# Altium schematic sheet LED controller - v1.0.SchDoc
size A4
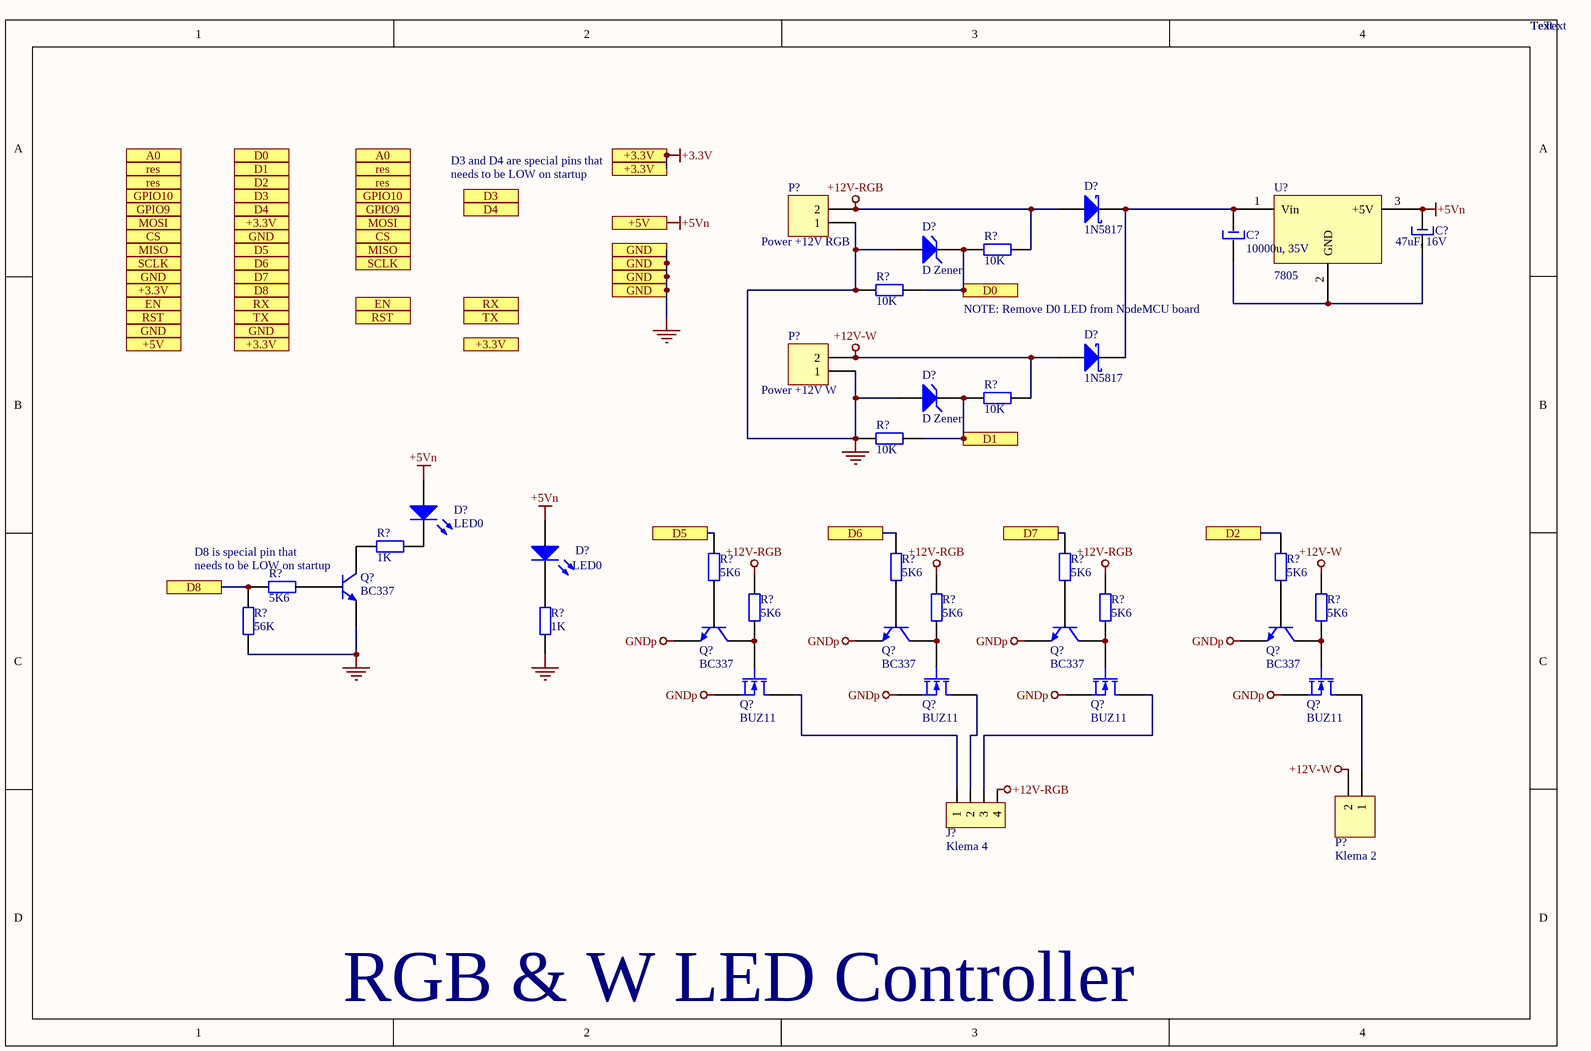
[diagram p0: LED controller - v1.0.SchDoc]

## Parts
(Parts that share a designator on the sheet are numbered #1, #2 ... from top to bottom, then left to right.)
C?#1  47uF, 16V  [Capacitor 10mikro]
C?#2  10000u, 35V  [Capacitor 10000u]
D?#1  1N5817  [Diode Schottky]
D?#2  D Zener  [DIODE-0.7]
D?#3  1N5817  [Diode Schottky]
D?#4  D Zener  [DIODE-0.7]
D?#5  LED0  [LED-0]
D?#6  LED0  [LED-0]
J?  Klema 4  [Conn4 3.96mm]
P?#1  Power +12V RGB  [HDR1X2]
P?#2  Power +12V W  [HDR1X2]
P?#3  Klema 2  [Pdnozje za napajanje]
Q?#1  BC337  [SOT-23]
Q?#2  BC337  [SOT-23]
Q?#3  BC337  [SOT-23]
Q?#4  BC337  [SOT-23]
Q?#5  BC337  [SOT-23]
Q?#6  BUZ11  [E3]
Q?#7  BUZ11  [E3]
Q?#8  BUZ11  [E3]
Q?#9  BUZ11  [E3]
R?#1  value 10K  [SMD0805]  (hidden comment: Resistor)
R?#2  value 10K  [SMD0805]  (hidden comment: Resistor)
R?#3  value 10K  [SMD0805]  (hidden comment: Resistor)
R?#4  value 10K  [SMD0805]  (hidden comment: Resistor)
R?#5  value 1K  [SMD0805]  (hidden comment: Resistor)
R?#6  5K6  [SMD0805]
R?#7  5K6  [SMD0805]
R?#8  5K6  [SMD0805]
R?#9  5K6  [SMD0805]
R?#10  value 5K6  [SMD0805]  (hidden comment: Resistor)
R?#11  5K6  [SMD0805]
R?#12  5K6  [SMD0805]
R?#13  5K6  [SMD0805]
R?#14  5K6  [SMD0805]
R?#15  value 56K  [SMD0805]  (hidden comment: Resistor)
R?#16  value 1K  [SMD0805]  (hidden comment: Resistor)
U?  7805  [D-PAK16]

## Ports
+3.3V, +5V, A0, CS, D0, D1, D2, D3, D4, D5, D6, D7, D8, EN, GND, GPIO9, GPIO10, MISO, MOSI, res, RST, RX, SCLK, TX

## Nets
+3.3V: port +3.3V
+5Vn: C?#1.1 D?#5.1(A) D?#6.1(A) U?.3(+5V) ; port +5V
+12V-RGB: D?#1.1(A) J?.4 P?#1.2 R?#1.1 R?#11.2 R?#12.2 R?#13.2
+12V-W: D?#3.1(A) P?#2.2 P?#3.2 R?#3.1 R?#14.2
GND: D?#2.1(A) D?#4.1(A) P?#1.1 P?#2.1 Q?#1.2(E) R?#2.2 R?#4.2 R?#15.1 R?#16.2 ; port GND
GNDp: Q?#2.2(E) Q?#3.2(E) Q?#4.2(E) Q?#5.2(E) Q?#6.3(S) Q?#7.3(S) Q?#8.3(S) Q?#9.3(S)
D0: D?#2.2(K) R?#1.2 R?#2.1 ; port D0
D1: D?#4.2(K) R?#3.2 R?#4.1 ; port D1
D2: R?#9.2 ; port D2
D5: R?#6.2 ; port D5
D6: R?#7.2 ; port D6
D7: R?#8.2 ; port D7
D8: R?#10.1 R?#15.2 ; port D8
NetC?#1_2: C?#1.2 C?#2.2 U?.2(GND)
NetC?#2_1: C?#2.1 D?#1.2(K) D?#3.2(K) U?.1(Vin)
NetD?#5_2: D?#5.2(K) R?#5.1
NetD?#6_2: D?#6.2(K) R?#16.1
NetJ?_1: J?.1 Q?#6.1(D)
NetJ?_2: J?.2 Q?#7.1(D)
NetJ?_3: J?.3 Q?#8.1(D)
NetP?#3_1: P?#3.1 Q?#9.1(D)
NetQ?#1_1: Q?#1.1(B) R?#10.2
NetQ?#1_3: Q?#1.3(C) R?#5.2
NetQ?#2_1: Q?#2.1(B) R?#6.1
NetQ?#2_3: Q?#2.3(C) Q?#6.2(G) R?#11.1
NetQ?#3_1: Q?#3.1(B) R?#7.1
NetQ?#3_3: Q?#3.3(C) Q?#7.2(G) R?#12.1
NetQ?#4_1: Q?#4.1(B) R?#8.1
NetQ?#4_3: Q?#4.3(C) Q?#8.2(G) R?#13.1
NetQ?#5_1: Q?#5.1(B) R?#9.1
NetQ?#5_3: Q?#5.3(C) Q?#9.2(G) R?#14.1

## Notes on the sheet
- Text
- D3 and D4 are special pins that
- needs to be LOW on startup
- NOTE: Remove D0 LED from NodeMCU board
- D8 is special pin that
- (near Q?#1) needs to be LOW on startup
- RGB & W LED Controller

## Library data of the parts
C?#1 = Capacitor 10mikro
C?#2 = Capacitor 10000u
D?#1 D?#3 = Diode Schottky
D?#2 D?#4 = D Zener: Zener Diode; Published: 8-Jun-2000; LatestRevisionDate: 17-Jul-2002; LatestRevisionNote: Re-released for DXP Platform.; PackageReference: DIODE-0.7; Publisher: Altium Limited; PackageDescription: Diode, Thru-Hole; 2 Leads; 0.7 in Pin Spacing
D?#5 D?#6 = LED0: Typical INFRARED GaAs LED; Published: 8-Jun-2000; LatestRevisionDate: 08-Jul-2005; LatestRevisionNote: Mech Layer 1 removed.; PackageReference: LED-0; Publisher: Altium Limited
J? = Conn4 3.96mm
P?#1-P?#3 = Header 2: Header, 2-Pin; LatestRevisionDate: 17-Jul-2002; LatestRevisionNote: Re-released for DXP Platform.; Publisher: Altium Limited
Q?#1-Q?#5 = BC817
Q?#6-Q?#9 = MOSFET-N: N-Channel MOSFET; PackageDocument: 1995/1996; Published: 8-Jun-2000; LatestRevisionDate: 17-Jul-2002; LatestRevisionNote: Re-released for DXP Platform.; PackageReference: E3; Publisher: Altium Limited
R?#1-R?#16 = Resistor 0.25W